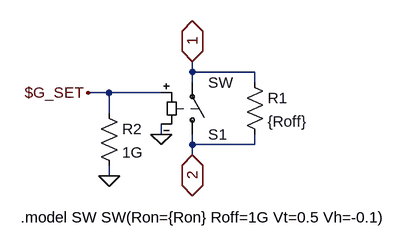
[diagram p0: schematic spstg2.asc]
spstg2.asc, the LTspice schematic file:
Version 4
SHEET 1 880 680
WIRE 224 64 224 48
WIRE 320 64 224 64
WIRE 224 80 224 64
WIRE 320 80 320 64
WIRE 96 96 64 96
WIRE 176 96 96 96
WIRE 96 128 96 96
WIRE 176 160 176 144
WIRE 224 176 224 160
WIRE 320 176 320 160
WIRE 320 176 224 176
WIRE 224 192 224 176
WIRE 96 224 96 208
FLAG 176 160 0
FLAG 64 96 $G_SET
FLAG 224 48 1
IOPIN 224 48 BiDir
FLAG 224 192 2
IOPIN 224 192 BiDir
FLAG 96 224 0
SYMBOL sw 224 176 M180
SYMATTR InstName S1
SYMBOL res 304 64 R0
SYMATTR InstName R1
SYMATTR Value {Roff}
SYMBOL res 80 112 R0
SYMATTR InstName R2
SYMATTR Value 1G
TEXT -40 288 Left 2 !.model SW SW(Ron={Ron} Roff=1G Vt=0.5 Vh=-0.1)

The netlist it stands for:
* spstg2.asc
S1 2 1 $G_SET 0 SW
R1 1 2 {Roff}
R2 $G_SET 0 1G
.model SW SW(Ron={Ron} Roff=1G Vt=0.5 Vh=-0.1)
.backanno
.end